# Altium project Accumulator_MGMT_Sys.PrjPcb (part 1 of 2)
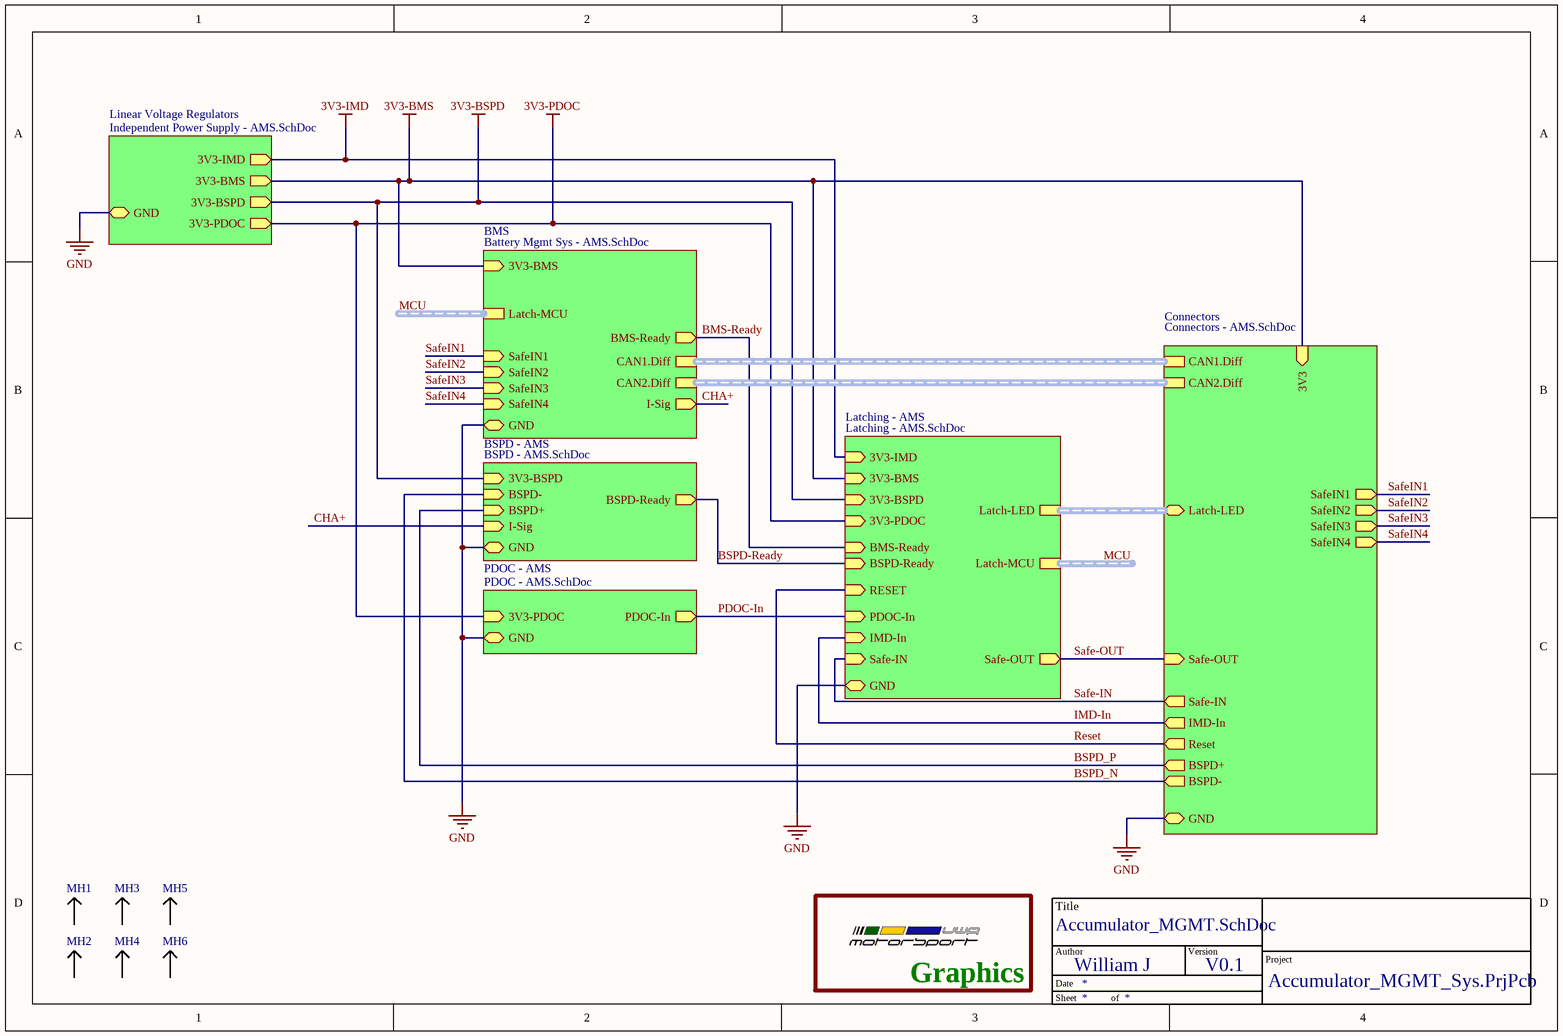
[diagram p0: Accumulator_MGMT.SchDoc]
ProAuthor: William J; ProjectTitle: Accumulator Management System; Version: V0.1
12 sheets, 240 parts. Net scope: hierarchical (ports join the sheet entries above them; power ports are global).
Board files: Accumulator Management.PcbDoc, AMS.PcbDoc
Sheets:
  Accumulator_MGMT.SchDoc
    BMS = Battery Mgmt Sys - AMS.SchDoc
      CAN-Trans = CAN - STM32F4.SchDoc
      Ext Current Sense = Current Sense - AMS.SchDoc
      Iso SPI Comms = Isolated Comms - AMS.SchDoc
    BSPD - AMS = BSPD - AMS.SchDoc
    Latching - AMS = Latching - AMS.SchDoc
      Latch Circuit = Latch - AMS.SchDoc
      Latch Circuit = Latch - AMS.SchDoc
      Latch Circuit = Latch - AMS.SchDoc
      Latch Circuit = Latch - AMS.SchDoc
    PDOC - AMS = PDOC - AMS.SchDoc
    Linear Voltage Regulators = Independent Power Supply - AMS.SchDoc
      Vbat-3V3 = LVR - AMS.SchDoc
      Vbat-3V3 = LVR - AMS.SchDoc
      Vbat-3V3 = LVR - AMS.SchDoc
    Connectors = Connectors - AMS.SchDoc

## Sheet Accumulator_MGMT.SchDoc
size A4

### Parts
(Parts that share a designator on the sheet are numbered #1, #2 ... from top to bottom, then left to right.)
*#1  TitleBlock  (value not drawn)  (graphical)
Graphic  UWAM Logo  [UWAM Logo]  (value not drawn)  (graphical)
MH1  M3 Mounting Hole  [M3 MH]  (value not drawn)  (no BOM)
MH2  M3 Mounting Hole  [M3 MH]  (value not drawn)  (no BOM)
MH3  M3 Mounting Hole  [M3 MH]  (value not drawn)  (no BOM)
MH4  M3 Mounting Hole  [M3 MH]  (value not drawn)  (no BOM)
MH5  M3 Mounting Hole  [M3 MH]  (value not drawn)  (no BOM)
MH6  M3 Mounting Hole  [M3 MH]  (value not drawn)  (no BOM)

### Blocks framed on the sheet
Graphics: Graphic

### Sub-sheets
BMS = Battery Mgmt Sys - AMS.SchDoc: BMS-Ready (out), 3V3-BMS (in), CAN1.Diff (harness CANDiff), CAN2.Diff (harness CANDiff), GND (bidir), I-Sig (out), SafeIN1 (in), SafeIN2 (in), SafeIN3 (in), SafeIN4 (in), Latch-MCU (harness Latch-MCU)
BSPD - AMS = BSPD - AMS.SchDoc: BSPD-Ready (out), 3V3-BSPD (in), BSPD- (in), BSPD+ (in), GND (bidir), I-Sig (in)
Connectors = Connectors - AMS.SchDoc: CAN1.Diff (harness CANDiff), CAN2.Diff (harness CANDiff), Safe-OUT (in), BSPD+ (out), Reset (out), Safe-IN (out), IMD-In (out), 3V3 (in), BSPD- (out), SafeIN1 (out), SafeIN2 (out), SafeIN3 (out), SafeIN4 (out), GND (bidir), Latch-LED (bidir, harness Latch-LED)
Latching - AMS = Latching - AMS.SchDoc: 3V3-IMD (in), 3V3-BMS (in), 3V3-BSPD (in), 3V3-PDOC (in), BSPD-Ready (in), BMS-Ready (in), PDOC-In (in), IMD-In (in), Safe-OUT (out), Safe-IN (in), RESET (in), GND (bidir), Latch-MCU (harness Latch-MCU), Latch-LED (harness Latch-LED)
Linear Voltage Regulators = Independent Power Supply - AMS.SchDoc: 3V3-IMD (out), 3V3-BMS (out), 3V3-BSPD (out), 3V3-PDOC (out), GND (bidir)
PDOC - AMS = PDOC - AMS.SchDoc: PDOC-In (out), 3V3-PDOC (in), GND (bidir)

### Nets
3V3-BMS: sheet BMS/3V3-BMS, sheet BSPD - AMS/3V3-BSPD, sheet Latching - AMS/3V3-IMD, sheet Latching - AMS/3V3-BMS, sheet Latching - AMS/3V3-BSPD, sheet Latching - AMS/3V3-PDOC, sheet PDOC - AMS/3V3-PDOC, sheet Linear Voltage Regulators/3V3-IMD, sheet Linear Voltage Regulators/3V3-BMS, sheet Linear Voltage Regulators/3V3-BSPD, sheet Linear Voltage Regulators/3V3-PDOC, sheet Connectors/3V3  [also labelled 3V3-BSPD, 3V3-IMD, 3V3-PDOC]
GND: sheet BMS/GND, sheet BSPD - AMS/GND, sheet Latching - AMS/GND, sheet PDOC - AMS/GND, sheet Linear Voltage Regulators/GND, sheet Connectors/GND
BMS-Ready: sheet BMS/BMS-Ready, sheet Latching - AMS/BMS-Ready
BSPD-Ready: sheet BSPD - AMS/BSPD-Ready, sheet Latching - AMS/BSPD-Ready
BSPD_N: sheet BSPD - AMS/BSPD-, sheet Connectors/BSPD-
BSPD_P: sheet BSPD - AMS/BSPD+, sheet Connectors/BSPD+
CHA+: sheet BMS/I-Sig, sheet BSPD - AMS/I-Sig
IMD-In: sheet Latching - AMS/IMD-In, sheet Connectors/IMD-In
PDOC-In: sheet Latching - AMS/PDOC-In, sheet PDOC - AMS/PDOC-In
Reset: sheet Latching - AMS/RESET, sheet Connectors/Reset
Safe-IN: sheet Latching - AMS/Safe-IN, sheet Connectors/Safe-IN
Safe-OUT: sheet Latching - AMS/Safe-OUT, sheet Connectors/Safe-OUT
SafeIN1: sheet BMS/SafeIN1, sheet Connectors/SafeIN1
SafeIN2: sheet BMS/SafeIN2, sheet Connectors/SafeIN2
SafeIN3: sheet BMS/SafeIN3, sheet Connectors/SafeIN3
SafeIN4: sheet BMS/SafeIN4, sheet Connectors/SafeIN4

Not connected (* = marked no-connect by the designer): MH1 1; MH2 1; MH3 1; MH4 1; MH5 1; MH6 1

### Buses and harness runs
harness MCU = sheet BMS/Latch-MCU
harness MCU = sheet Latching - AMS/Latch-MCU
harness sheet BMS/CAN1.Diff = sheet Connectors/CAN1.Diff
harness sheet BMS/CAN2.Diff = sheet Connectors/CAN2.Diff
harness sheet Connectors/Latch-LED = sheet Latching - AMS/Latch-LED

### Notes on the sheet
- (in symbol TitleBlock) Title; Author; Version; Project; Date; Sheet; of

## Sheet Battery Mgmt Sys - AMS.SchDoc
size A4
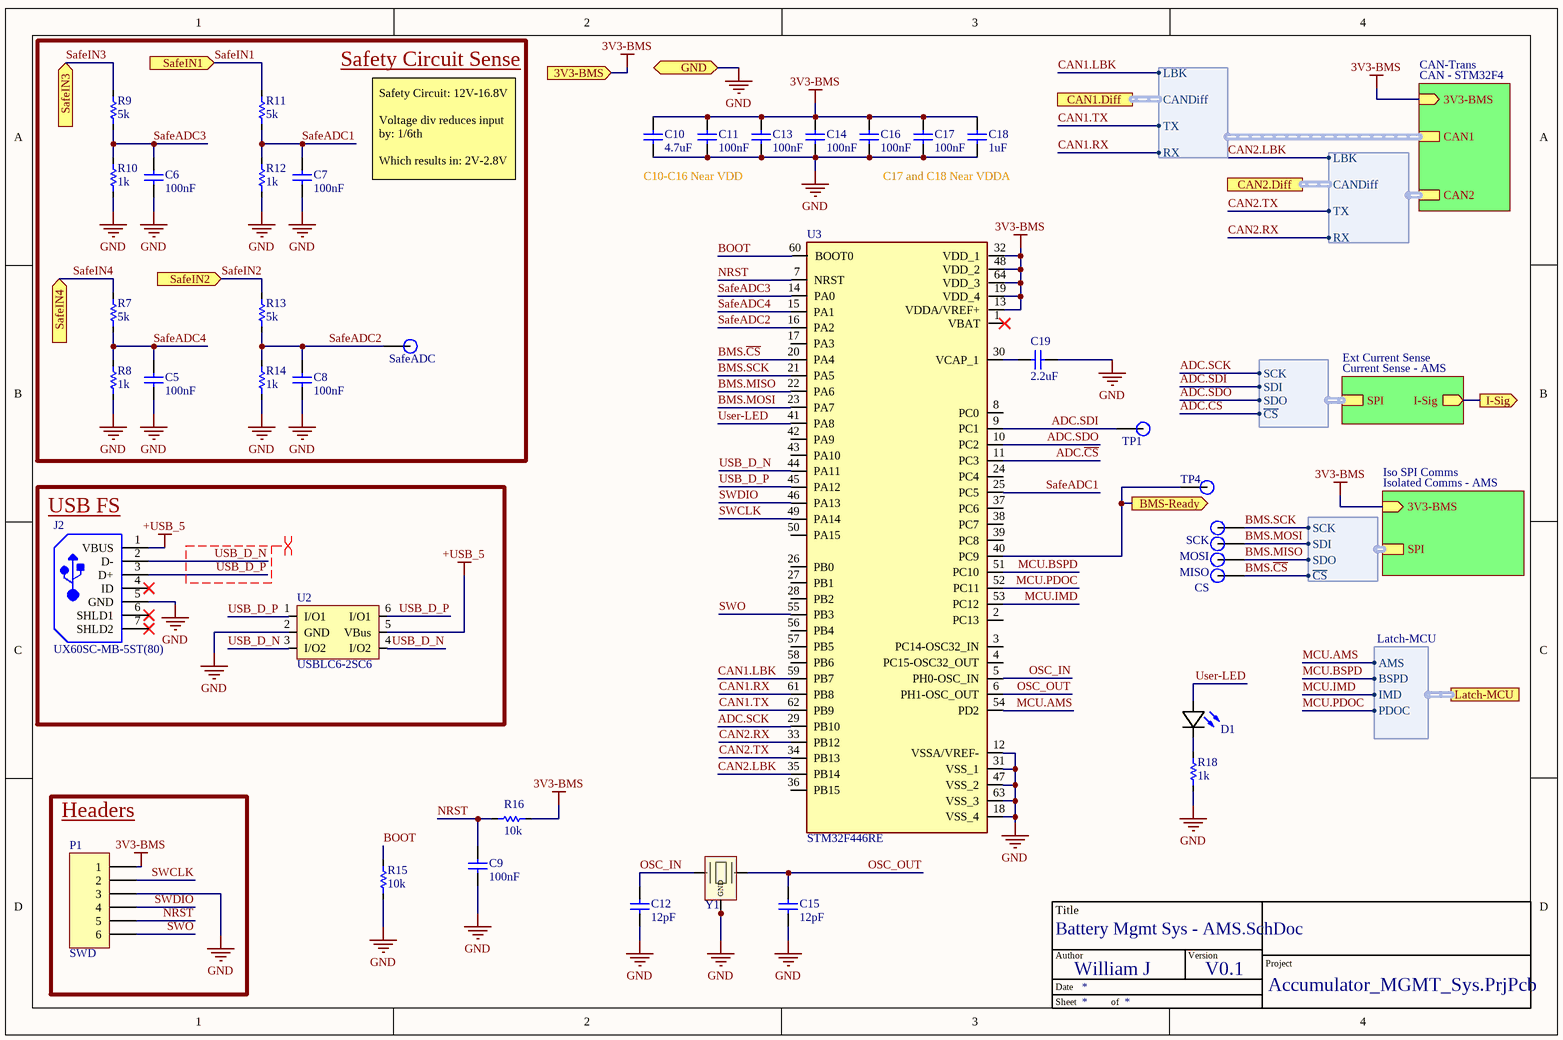
[diagram p1: Battery Mgmt Sys - AMS.SchDoc]

### Parts
(Parts that share a designator on the sheet are numbered #1, #2 ... from top to bottom, then left to right.)
*#2  TitleBlock  (value not drawn)  (graphical)
C5  value 100nF  [C_0603]  (hidden comment: C0603C104K3RAC7013)
C6  value 100nF  [C_0603]  (hidden comment: C0603C104K3RAC7013)
C7  value 100nF  [C_0603]  (hidden comment: C0603C104K3RAC7013)
C8  value 100nF  [C_0603]  (hidden comment: C0603C104K3RAC7013)
C9  value 100nF  [C_0603]  (hidden comment: C0603C104K3RAC7013)
C10  value 4.7uF  [C_0603]  (hidden comment: CL10A475KP8NNNL)
C11  value 100nF  [C_0603]  (hidden comment: C0603C104K3RAC7013)
C12  value 12pF  [0402]  (hidden comment: GCM1555C1H120FA16D)
C13  value 100nF  [C_0603]  (hidden comment: C0603C104K3RAC7013)
C14  value 100nF  [C_0603]  (hidden comment: C0603C104K3RAC7013)
C15  value 12pF  [0402]  (hidden comment: GCM1555C1H120FA16D)
C16  value 100nF  [C_0603]  (hidden comment: C0603C104K3RAC7013)
C17  value 100nF  [C_0603]  (hidden comment: C0603C104K3RAC7013)
C18  value 1uF  [C_0603]  (hidden comment: CL10A105KP8NNNL)
C19  value 2.2uF  [C_0603]  (hidden comment: CL10A225KP8NNNC)
CS  Test Point  [Test Point]  (value not drawn)  (no BOM)
D1  150060BS55040  [LED (0603)]  (value not drawn)
J2  UX60SC-MB-5ST(80)  [HIRO-UX60SC-MB-5ST(80)_V]
MISO  Test Point  [Test Point]  (value not drawn)  (no BOM)
MOSI  Test Point  [Test Point]  (value not drawn)  (no BOM)
P1  SWD  [HDR1X6]  (no BOM)
R7  value 5k  [R-0603]  (hidden comment: CR0603AFX-5101EAS)
R8  value 1k  [R-0603]  (hidden comment: CR0603AFX-1001ELF)
R9  value 5k  [R-0603]  (hidden comment: CR0603AFX-5101EAS)
R10  value 1k  [R-0603]  (hidden comment: CR0603AFX-1001ELF)
R11  value 5k  [R-0603]  (hidden comment: CR0603AFX-5101EAS)
R12  value 1k  [R-0603]  (hidden comment: CR0603AFX-1001ELF)
R13  value 5k  [R-0603]  (hidden comment: CR0603AFX-5101EAS)
R14  value 1k  [R-0603]  (hidden comment: CR0603AFX-1001ELF)
R15  value 10k  [R-0603]  (hidden comment: RC0603FR-1310KL)
R16  value 10k  [R-0603]  (hidden comment: RC0603FR-1310KL)
R18  value 1k  [R-0603]  (hidden comment: CR0603AFX-1001ELF)
SafeADC  Test Point  [Test Point]  (value not drawn)  (no BOM)
SCK  Test Point  [Test Point]  (value not drawn)  (no BOM)
TP1  Test Point  [Test Point]  (value not drawn)  (no BOM)
TP4  Test Point  [Test Point]  (value not drawn)  (no BOM)
U2  USBLC6-2SC6  [USBLC6-2SC6]
U3  STM32F446RE  [QFP50P1200X1200X160-64N]
Y1  CX2016DB26000D0FLJCC  [CX2016DB26000D0FLJCC]  (value not drawn)

### Blocks framed on the sheet
Safety Circuit Sense: C5-C8 R7-R14 SafeADC
USB FS: J2 U2
Headers: P1

### Sub-sheets
CAN-Trans = CAN - STM32F4: CAN2 (harness CAN), CAN1 (harness CAN), 3V3-BMS (in)
Ext Current Sense = Current Sense - AMS: SPI (harness SPI), I-Sig (out)
Iso SPI Comms = Isolated Comms - AMS: SPI (harness SPI), 3V3-BMS (in)

### Ports
3V3-BMS (in), BMS-Ready (out), CAN1.Diff (harness CANDiff), CAN2.Diff (harness CANDiff), GND (bidir), I-Sig (out), Latch-MCU (harness Latch-MCU), SafeIN1 (in), SafeIN2 (in), SafeIN3 (in), SafeIN4 (in)

### Harnesses
SPI: SDI, SDO, ~{CS}, SCK
CAN: LBK, CANDiff, TX, RX
Latch-MCU: AMS, BSPD, IMD, PDOC

### Nets
3V3-BMS: C10.2 C11.2 C13.2 C14.2 C16.2 C17.2 C18.2 P1.1 R16.2 U3.13(VDDA/VREF+) U3.19(VDD_4) U3.32(VDD_1) U3.48(VDD_2) U3.64(VDD_3) ; port 3V3-BMS, sheet CAN-Trans/3V3-BMS, sheet Iso SPI Comms/3V3-BMS
+USB_5: J2.1(VBUS) U2.5(VBus)
GND: C5.1 C6.1 C7.1 C8.1 C9.1 C10.1 C11.1 C12.1 C13.1 C14.1 C15.1 C16.1 C17.1 C18.1 C19.1 J2.5(GND) P1.3 R8.1 R10.1 R12.1 R14.1 R15.1 R18.1 U2.2(GND) U3.12(VSSA/VREF-) U3.18(VSS_4) U3.31(VSS_1) U3.47(VSS_2) U3.63(VSS_3) Y1.2(GND) Y1.4(GND) ; port GND
ADC.~{CS}: U3.11(PC3) ; sheet Ext Current Sense/SPI.~{CS}
ADC.SCK: U3.29(PB10) ; sheet Ext Current Sense/SPI.SCK
ADC.SDI: TP1.1 U3.9(PC1) ; sheet Ext Current Sense/SPI.SDI
ADC.SDO: U3.10(PC2) ; sheet Ext Current Sense/SPI.SDO
BMS-Ready: TP4.1 U3.40(PC9) ; port BMS-Ready
BMS.~{CS}: CS.1 U3.20(PA4) ; sheet Iso SPI Comms/SPI.~{CS}
BMS.MISO: MISO.1 U3.22(PA6) ; sheet Iso SPI Comms/SPI.SDO
BMS.MOSI: MOSI.1 U3.23(PA7) ; sheet Iso SPI Comms/SPI.SDI
BMS.SCK: SCK.1 U3.21(PA5) ; sheet Iso SPI Comms/SPI.SCK
BOOT: R15.2 U3.60(BOOT0)
CAN1.LBK: U3.59(PB7) ; sheet CAN-Trans/CAN1.LBK
CAN1.RX: U3.61(PB8) ; sheet CAN-Trans/CAN1.RX
CAN1.TX: U3.62(PB9) ; sheet CAN-Trans/CAN1.TX
CAN2.LBK: U3.35(PB14) ; sheet CAN-Trans/CAN2.LBK
CAN2.RX: U3.33(PB12) ; sheet CAN-Trans/CAN2.RX
CAN2.TX: U3.34(PB13) ; sheet CAN-Trans/CAN2.TX
CHA+: port I-Sig, sheet Ext Current Sense/I-Sig
MCU.AMS: U3.54(PD2) ; port Latch-MCU.AMS
MCU.BSPD: U3.51(PC10) ; port Latch-MCU.BSPD
MCU.IMD: U3.53(PC12) ; port Latch-MCU.IMD
MCU.PDOC: U3.52(PC11) ; port Latch-MCU.PDOC
NRST: C9.2 P1.5 R16.1 U3.7(NRST)
OSC_IN: C12.2 U3.5(PH0-OSC_IN) Y1.1
OSC_OUT: C15.2 U3.6(PH1-OSC_OUT) Y1.3
SafeADC1: C7.2 R11.1 R12.2 U3.25(PC5)
SafeADC2: C8.2 R13.1 R14.2 SafeADC.1 U3.16(PA2)
SafeADC3: C6.2 R9.1 R10.2 U3.14(PA0)
SafeADC4: C5.2 R7.1 R8.2 U3.15(PA1)
SafeIN1: R11.2 ; port SafeIN1
SafeIN2: R13.2 ; port SafeIN2
SafeIN3: R9.2 ; port SafeIN3
SafeIN4: R7.2 ; port SafeIN4
SWCLK: P1.2 U3.49(PA14)
SWDIO: P1.4 U3.46(PA13)
SWO: P1.6 U3.55(PB3)
USB_D_N: J2.2(D-) U2.3(I/O2) U2.4(I/O2) U3.44(PA11)
USB_D_P: J2.3(D+) U2.1(I/O1) U2.6(I/O1) U3.45(PA12)
User-LED: D1.2(A) U3.41(PA8)
NetC19_2: C19.2 U3.30(VCAP_1)
NetD1_1: D1.1(K) R18.2

Not connected (* = marked no-connect by the designer): J2 4(ID)* 6(SHLD1)* 7(SHLD2)*; U3 1(VBAT)* 2(PC13) 3(PC14-OSC32_IN) 4(PC15-OSC32_OUT) 8(PC0) 17(PA3) 24(PC4) 26(PB0) 27(PB1) 28(PB2) 36(PB15) 37(PC6) 38(PC7) 39(PC8) 42(PA9) 43(PA10) 50(PA15) 56(PB4) 57(PB5) 58(PB6)

### Layout directives
differential pair; net class USB_Diff: USB_D_N, USB_D_P

### Notes on the sheet
- Safety Circuit: 12V-16.8V
  Voltage div reduces input by: 1/6th
  Which results in: 2V-2.8V
- C10-C16 Near VDD
- C17 and C18 Near VDDA
- (in symbol TitleBlock) Title; Author; Version; Project; Date; Sheet; of

### Library data of the parts
C5-C19 = Capacitor: ComponentLink1Description: New link; ComponentLink1URL: *
CS MISO MOSI SafeADC SCK TP1 TP4 = Test Point: 1.2mm Test point
D1 = 150060BS55040: LED BLUE DIFFUSED 0603 SMD; Manufacturer: Wurth Electronics; Lens Style: Flat; Luminous Intensity: 80mcd; Forward Voltage: 3.2V; Test Current: 20mA; Viewing Angle: 140°; Dominant Wavelength: 470nm; Lens Size: 0.8mm; Supplier 1: Mouser; Manufacturer Part Number: 150060BS55040; RoHS: No; Pricing 1: 1=0.18000, 10=0.16800, 50=0.16800, 100=0.15200, 1000=0.12100, 10000=0.10600 (USD); Mount: Surface Mount; Case/Package: 0603; Color: Blue; Packaging: Tape and Reel; Lens Transparency: Diffused; Length: 1.6mm; Width: 0.8mm; Height: 0.5mm; RoHS Compliant: No; ComponentLink1URL: http://www.farnell.com/datasheets/2621640.pdf?src-supplier=Farnell; ComponentLink1Description: http://www.farnell.com/datasheets/2621640.pdf?src-supplier=Farnell; ComponentLink2URL: https://www.we-online.de/web/en/index.php/download/media/07_electronic_components/download_center_1/application_notes_berichte/ano002_leds___the_future_of_horticultural_lighting/ANO002b_EN_LEDs_The_Future_of_Horticultural_Lighting.pdf?src-supplier=Digi-Key; ComponentLink2Description: https://www.we-online.de/web/en/index.php/download/media/07_electronic_components/download_center_1/application_notes_berichte/ano002_leds___the_future_of_horticultural_lighting/ANO002b_EN_LEDs_The_Future_of_Horticultural_Lighting.pdf?src-supplier=Digi-Key; ComponentLink3URL: https://katalog.we-online.de/pbs/datasheet/150060BS55040.pdf?src-supplier=Digi-Key; ComponentLink3Description: https://katalog.we-online.de/pbs/datasheet/150060BS55040.pdf?src-supplier=Digi-Key; ComponentLink4URL: http://www.farnell.com/datasheets/2621640.pdf?src-supplier=Newark; ComponentLink4Description: http://www.farnell.com/datasheets/2621640.pdf?src-supplier=Newark; Supplier Part Number 1: 710-150060BS55040
J2 = CMP-2000-07376-1: Mini-B Connector, SMT Mount Receptacle Meeting Requirement of USB 2.0 Standard, 5 V, 1 A, -30 to 75 degC, 5-Pin SMD, RoHS, Tape and Reel; Manufacturer: Hirose Electric; Product Length (mm): 7.7mm; Voltage Rating Max: 5VAC; Number of Contacts: 5POS; Number of Ports: 1Port; Product Height (mm): 3.95mm; Product Depth (mm): 7mm; Pitch (mm): 0.8mm; Gender: RCP; Current Rating (Max): 1A; DELETED: Compliant; Product Diameter (mm): NotRequiredmm; Body Orientation: RightAngle; Operating Temp Range: -30Cto75C; Packaging: TapeandReel; Termination Method: Solder; Number of Terminals: 5; Package Description: 5-Pin Surface Mount Device, Body 7.7 x 7 mm, Pitch 0.8 mm; Mounting Technology: SurfaceMount; Contact Material: CopperAlloy; Package Reference: UX60SC-MB-5ST(80); Operating Temperature Min Deg. C: -30C; Housing Material: Synthetic; Operating Temperature Max Deg. C: 75C; Manufacturer URL: https://www.hirose.com; Datasheet Version: 04/2008; Type: Mini-USB; Datasheet URL: https://datasheet.ciiva.com/4598/e24000153-34949-4598883.pdf; Contact Plating: Gold; Mounting Style: ThroughHole
P1 = Header 6: Header, 6-Pin; LatestRevisionDate: 17-Jul-2002; LatestRevisionNote: Re-released for DXP Platform.; Publisher: Altium Limited
R7 R9 R11 R13 R15 R16 R18 = Resistor
R8 R10 R12 R14 = Resistor: Voltage divider
U2 = USBLC6-2SC6: TVS DIODE 5.25V 17V SOT23-6; Manufacturer: STMicroelectronics; Direction: Unidirectional,Bidirectional; Capacitance: 3.5pF; Operating Supply Voltage: 1.1V; Number of Channels: 2; Breakdown Voltage: 6V; Power Line Protection: Yes; Test Current: 1mA; Max Reverse Leakage Current: 150nA; Peak Pulse Current: 5A; Element Configuration: Dual; Data Rate: 480Mbps; Number of Elements: 1; Working Voltage: 5V; Supplier 1: RSComponents; Manufacturer Part Number: USBLC6-2SC6; RoHS: Yes; Category: TVS Diodes; Stock 1: 1; Pricing 1: 10=0.61400, 50=0.57700, 100=0.54700, 250=0.51600, 500=0.49000 (USD); Mount: Surface Mount; Case/Package: SOT-23; Number of Pins: 6; Contact Plating: Tin,Matte; Min Operating Temperature: -40°C; Max Operating Temperature: 125°C; Clamping Voltage: 17V; Packaging: Tape and Reel; Package Quantity: 3000; Termination: SMD/SMT; Number of Bidirectional Channels: 2; Reverse Standoff Voltage: 5.25V; Min Breakdown Voltage: 6V; ESD Protection: Yes; Leakage Current: 150nA; Series: USB; Reverse Breakdown Voltage: 6V; Polarity: Unidirectional,Bidirectional; Max Breakdown Voltage: 6V; Clamping Voltage-Max: 17V; Length: 3.05mm; Width: 1.75mm; Height: 1.3mm; Depth: 1.75mm; Radiation Hardening: No; REACH SVHC: No SVHC; Lead Free: Lead Free; RoHS Compliant: Yes; ComponentLink1URL: https://datasheet.ciiva.com/1268/1690354-1268384.pdf?src-supplier=Element14; ComponentLink1Description: https://datasheet.ciiva.com/1268/1690354-1268384.pdf?src-supplier=Element14; ComponentLink2URL: https://datasheet.ciiva.com/4508/cd00050750-113117-4508433.pdf?src-supplier=Mouser; ComponentLink2Description: https://datasheet.ciiva.com/4508/cd00050750-113117-4508433.pdf?src-supplier=Mouser; ComponentLink3URL: https://datasheet.ciiva.com/15143/getdatasheetpartid-148465-15143789.pdf?src-supplier=Verical; ComponentLink3Description: https://datasheet.ciiva.com/15143/getdatasheetpartid-148465-15143789.pdf?src-supplier=Verical; ComponentLink4URL: https://datasheet.ciiva.com/26787/usblc6-2sc6-26787908.pdf?src-supplier=IIIC; ComponentLink4Description: https://datasheet.ciiva.com/26787/usblc6-2sc6-26787908.pdf?src-supplier=IIIC; ComponentLink5URL: https://datasheet.ciiva.com/16200/cd00050750-16200026.pdf?src-supplier=Future+Electronics; ComponentLink5Description: https://datasheet.ciiva.com/16200/cd00050750-16200026.pdf?src-supplier=Future+Electronics; ComponentLink6URL: https://datasheet.ciiva.com/41444/001184109-da-01-en-ic-esd-protecti-usblc6-2sc6-sot-23-6-stm-41444156.pdf?src-supplier=Conrad; ComponentLink6Description: https://datasheet.ciiva.com/41444/001184109-da-01-en-ic-esd-protecti-usblc6-2sc6-sot-23-6-stm-41444156.pdf?src-supplier=Conrad; Supplier Part Number 1: 6247693
U3 = STM32F446RE: 32 Bit Microcontroller, High Performance, ARM Cortex-M4, 180 MHz, 256 KB, 128 KB, 64, LQFP; MP: STM32F446RE; Value: *
Y1 = CX2016DB26000D0FLJCC: Crystals AEC-Q200 26000kHz 8pF 2x1.6mm

## Sheet CAN - STM32F4.SchDoc
size A4
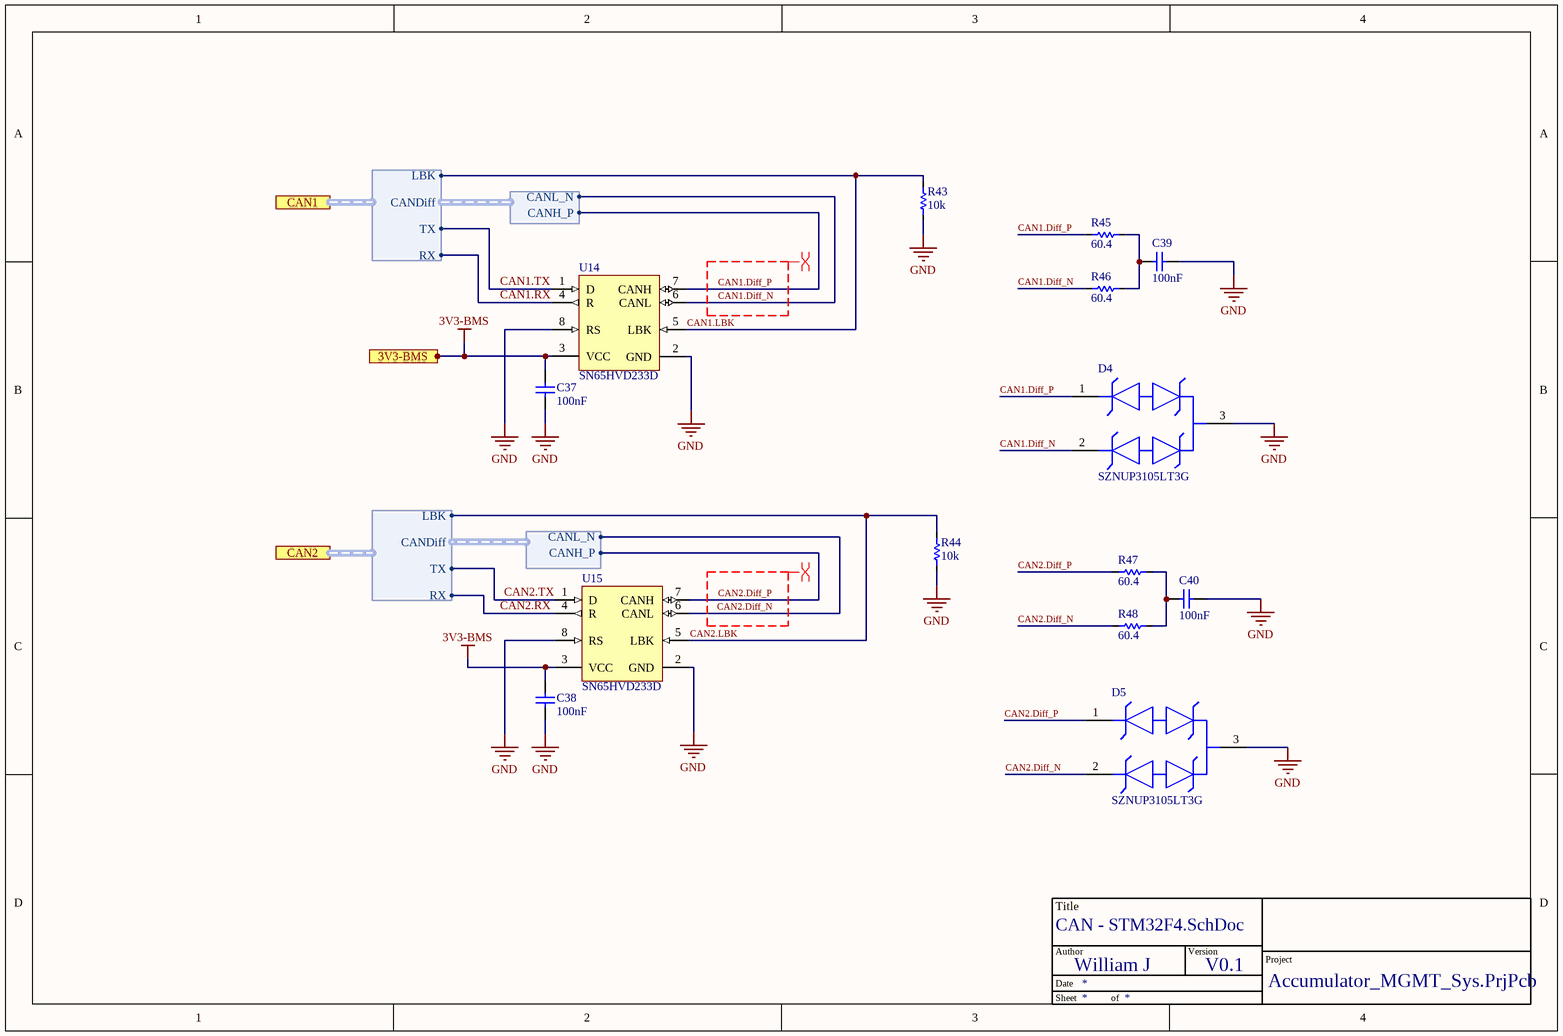
[diagram p2: CAN - STM32F4.SchDoc]

### Parts
(Parts that share a designator on the sheet are numbered #1, #2 ... from top to bottom, then left to right.)
*#3  TitleBlock  (value not drawn)  (graphical)
C37  value 100nF  [C_0603]  (hidden comment: C0603C104K3RAC7013)
C38  value 100nF  [C_0603]  (hidden comment: C0603C104K3RAC7013)
C39  value 100nF  [C_0603]  (hidden comment: C0603C104K3RAC7013)
C40  value 100nF  [C_0603]  (hidden comment: C0603C104K3RAC7013)
D4  SZNUP3105LT3G  [FP-318-08-MFG]
D5  SZNUP3105LT3G  [FP-318-08-MFG]
R43  value 10k  [R-0603]  (hidden comment: RC0603FR-1310KL)
R44  value 10k  [R-0603]  (hidden comment: RC0603FR-1310KL)
R45  value 60.4  [R-0603]  (hidden comment: CRCW080560R4FKEA)
R46  value 60.4  [R-0603]  (hidden comment: CRCW080560R4FKEA)
R47  value 60.4  [R-0603]  (hidden comment: CRCW080560R4FKEA)
R48  value 60.4  [R-0603]  (hidden comment: CRCW080560R4FKEA)
U14  SN65HVD233D  [D0008A_N]
U15  SN65HVD233D  [D0008A_N]

### Ports
3V3-BMS (in), CAN1 (harness CAN), CAN2 (harness CAN)

### Harnesses
CAN: LBK, CANDiff, TX, RX
CANDiff: CANL_N, CANH_P
CANDiff: CANH_P, CANL_N

### Nets
3V3-BMS: C37.2 C38.2 U14.3(VCC) U15.3(VCC) ; port 3V3-BMS
GND: C37.1 C38.1 C39.1 C40.1 D4.3 D5.3 R43.1 R44.1 U14.2(GND) U14.8(RS) U15.2(GND) U15.8(RS)
CAN1.Diff_N: D4.2 R46.1 U14.6(CANL) ; harness CANDiff.CANL_N
CAN1.Diff_P: D4.1 R45.1 U14.7(CANH) ; harness CANDiff.CANH_P
CAN1.LBK: R43.2 U14.5(LBK) ; port CAN1.LBK
CAN1.RX: U14.4(R) ; port CAN1.RX
CAN1.TX: U14.1(D) ; port CAN1.TX
CAN2.Diff_N: D5.2 R48.1 U15.6(CANL) ; harness CANDiff.CANL_N
CAN2.Diff_P: D5.1 R47.1 U15.7(CANH) ; harness CANDiff.CANH_P
CAN2.LBK: R44.2 U15.5(LBK) ; port CAN2.LBK
CAN2.RX: U15.4(R) ; port CAN2.RX
CAN2.TX: U15.1(D) ; port CAN2.TX
NetC39_2: C39.2 R45.2 R46.2
NetC40_2: C40.2 R47.2 R48.2

### Layout directives
differential pair; net class CAN_Diff; differential pair class CAN_Diff: CAN1.Diff_N, CAN1.Diff_P, CAN2.Diff_N, CAN2.Diff_P

### Notes on the sheet
- (in symbol TitleBlock) Title; Author; Version; Project; Date; Sheet; of

### Library data of the parts
C37-C40 = Capacitor: ComponentLink1Description: New link; ComponentLink1URL: *
D4 D5 = CMP-07200-000005-1: TVS DIODE 32V 66V SOT23-3; Manufacturer: ON Semiconductor; Max Junction Temp: +150°C; Standoff Height: 0.01mm; Peak Pulse Power: 350W; Breakdown Voltage: 35.6V; Automotive Grade: Grade 0; Number Of Channels: 2; Direction: Bidirectional; Peak Pulse Current: 8A; Height: 1.11mm; Mouser Description: 32V Dual Line CAN Bus Protector in SOT-23 AEC-Q 24 V CAN Bus Protector in SOT-23; Device Class L3: unset; Clamping Voltage: 66V; Manufacturer Part Number: SZNUP3105LT3G; ComponentLink2Description: Datasheet; Octopart: https://octopart.com/sznup3105lt3g-on+semiconductor-54318507; Temperature Range High: +150°C; Reverse Standoff Voltage: 32V; RoHS: TRUE; Package: 318-08; Device Class L2: TVS Diodes; Device Class L1: Circuit Protection; Temperature Range Low: -55°C; Lead Free: Yes; Temperature: -55°C to +150°C; ComponentLink2URL: https://www.onsemi.com/pub/Collateral/NUP3105L-D.PDF; Automotive: Yes; Footprint Url: https://www.onsemi.com/pub/Collateral/318-08.PDF; Digikey Description: TVS DIODE 32V 66V SOT23-3; Category: Diode
R43-R48 = Resistor
U14 U15 = CMP-0315-00036-2: 3.3V CAN Transceiver with Standby Mode, Loop-back, 6 mA, -40 to 125 degC, 8-pin SOIC (D), Green (RoHS & no Sb/Br); Manufacturer: Texas Instruments; Receivers Per Package: 1; Bus Fault Voltage(V): +/-30; Rating: Catalog; ICC(Max)(mA): 6; Supply Voltage(s)(V): 3.3; Transient Pulse Protection(V): -100 to 100; PackageVersion: revM, Jun-2011; PackageReference: D0008A; ComponentLink1Description: Datasheet; Isolated: No; Footprint: PCA82C250, excludes pin5; DatasheetVersion: SLLS557F; PackageDescription: 8-Pin Plastic Small Outline Integrated Circuit, 4.9 x 3.9 mm, Pitch 1.27 mm Pitch; Features: Loop Back; Low Power Mode: Standby; SubFamily: CAN; Drivers Per Package: 1; Eco-Plan: Green (RoHS & no Sb/Br); ComponentLink1URL: http://www.ti.com/general/docs/lit/getliterature.tsp?genericPartNumber=SN65HVD233&fileType=pdf; PartNumber: SN65HVD233D; Code_JEDEC: MS-012AA; Mounting Technology: Surface Mount

## Sheet Current Sense - AMS.SchDoc
size A4
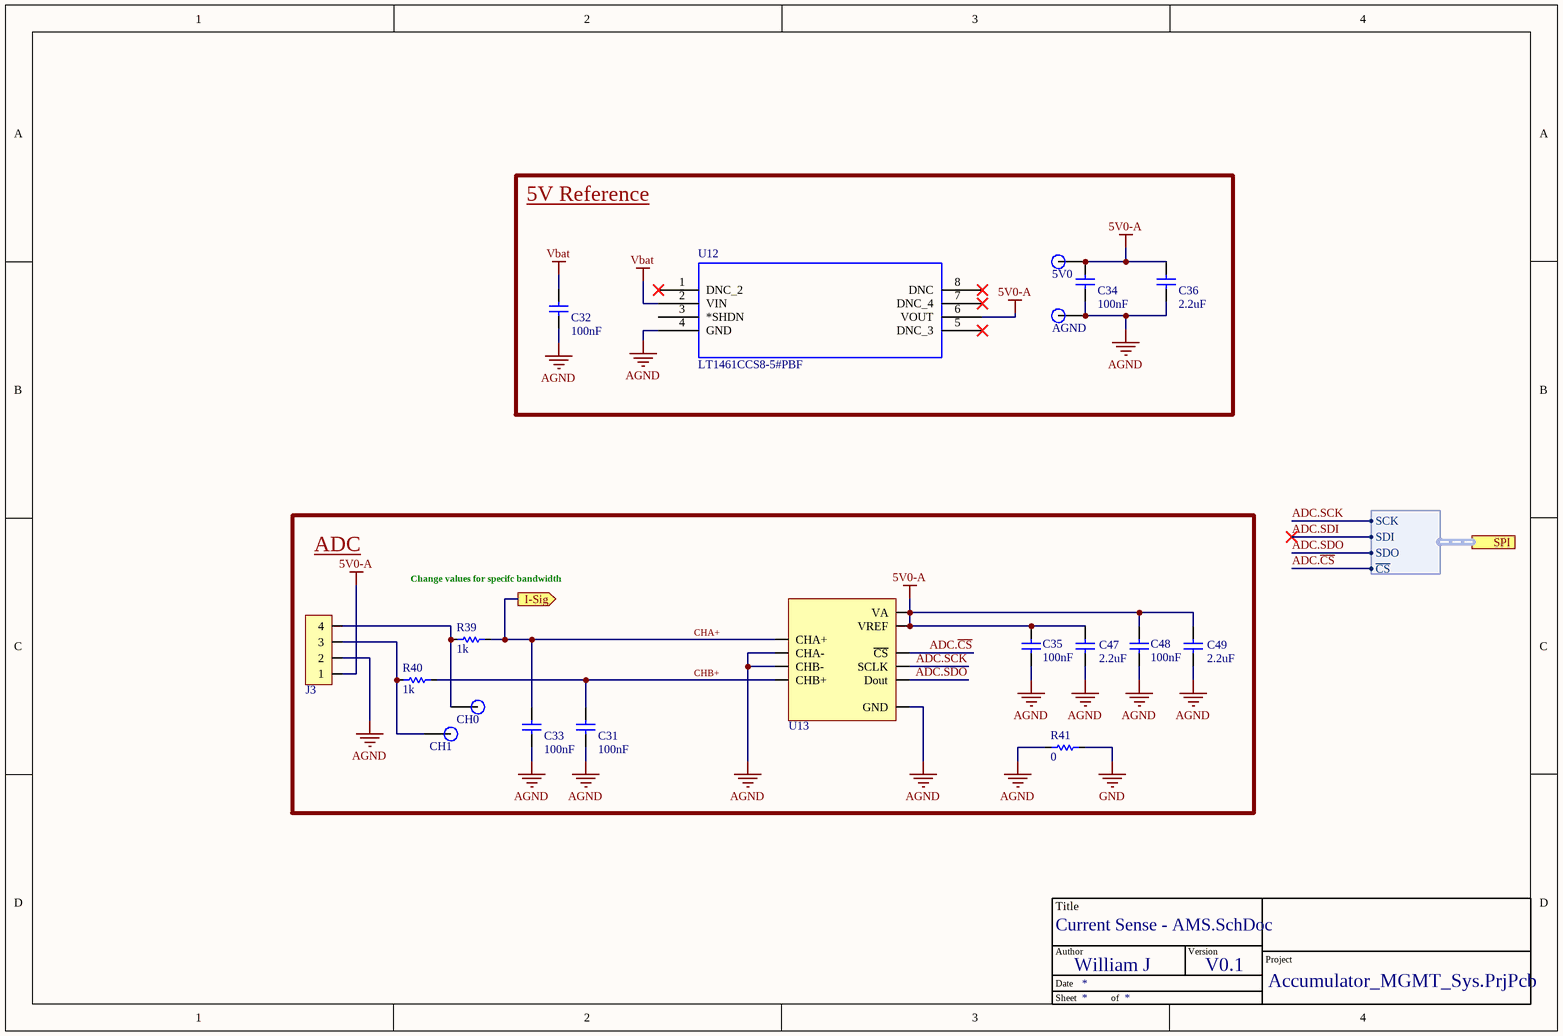
[diagram p3: Current Sense - AMS.SchDoc]

### Parts
(Parts that share a designator on the sheet are numbered #1, #2 ... from top to bottom, then left to right.)
5V0  1.2mm Test point  [Test Point]  (value not drawn)  (no BOM)
*#4  TitleBlock  (value not drawn)  (graphical)
AGND  1.2mm Test point  [Test Point]  (value not drawn)  (no BOM)
C31  value 100nF  [0402]  (hidden comment: C0603C104K3RAC7013)
C32  value 100nF  [C_0603]  (hidden comment: C0603C104K3RAC7013)
C33  value 100nF  [0402]  (hidden comment: C0603C104K3RAC7013)
C34  value 100nF  [C_0603]  (hidden comment: C0603C104K3RAC7013)
C35  value 100nF  [C_0603]  (hidden comment: C0603C104K3RAC7013)
C36  value 2.2uF  [C_0603]  (hidden comment: CL10A225KP8NNNC)
C47  value 2.2uF  [C_0603]  (hidden comment: CL10A225KP8NNNC)
C48  value 100nF  [C_0603]  (hidden comment: C0603C104K3RAC7013)
C49  value 2.2uF  [C_0603]  (hidden comment: CL10A225KP8NNNC)
CH0  1.2mm Test point  [Test Point]  (value not drawn)  (no BOM)
CH1  1.2mm Test point  [Test Point]  (value not drawn)  (no BOM)
J3  3-794632-4  [3-794632-4]  (value not drawn)
R39  value 1k  [R_0402]  (hidden comment: CRT0402-DY-1001GLF)
R40  value 1k  [R_0402]  (hidden comment: CRT0402-DY-1001GLF)
R41  value 0  [R-0603]  (hidden comment: AC0603JR-100RL)
U12  LT1461CCS8-5#PBF  [SO-8_S]
U13  ADC122S625CIMM/NOPB  [TSSOP50P490X110-10N]  (value not drawn)

### Blocks framed on the sheet
5V Reference: 5V0 AGND C32 C34 C36 U12
ADC: C31 C33 C35 C47-C49 CH0 CH1 J3 R39-R41 U13

### Ports
I-Sig (out), SPI (harness SPI)

### Harnesses
SPI: SDI, SDO, ~{CS}, SCK

### Nets
5V0-A: 5V0.1 C34.2 C35.2 C36.2 C47.2 C48.2 C49.2 J3.1 U12.6(VOUT) U13.1(VREF) U13.7(VA)
AGND: AGND.1 C31.1 C32.1 C33.1 C34.1 C35.1 C36.1 C47.1 C48.1 C49.1 J3.2 R41.1 U12.4(GND) U13.3(CHA-) U13.4(CHB-) U13.6(GND)
GND: R41.2
Vbat: C32.2 U12.2(VIN)
ADC.~{CS}: U13.10(~{CS}) ; port SPI.~{CS}
ADC.SCK: U13.9(SCLK) ; port SPI.SCK
ADC.SDO: U13.8(Dout) ; port SPI.SDO
CHA+: C33.2 R39.2 U13.2(CHA+) ; port I-Sig
CHB+: C31.2 R40.2 U13.5(CHB+)
NetCH0_1: CH0.1 J3.4 R39.1
NetCH1_1: CH1.1 J3.3 R40.1

Not connected (* = marked no-connect by the designer): U12 1(DNC_2)* 3(*SHDN) 5(DNC_3)* 7(DNC_4)* 8(DNC)*

### Notes on the sheet
- Change values for specifc bandwidth
- (in symbol TitleBlock) Title; Author; Version; Project; Date; Sheet; of

### Library data of the parts
5V0 AGND CH0 CH1 = Test Point
C31-C36 C47-C49 = Capacitor: ComponentLink1Description: New link; ComponentLink1URL: *
J3 = 3-794632-4: Conn Power HDR 4 POS 3mm Solder ST Thru-Hole 4 Terminal 1 Port Box/Tray; Manufacturer: TE Connectivity; Number of Terminals/Pins: 4; Max Voltage Rating (AC): 250V; Connector Type: Pin; Mating Retention: Yes (With); PCB Mount Alignment: No (Without); Current Rating: 5A; Number of Ports: 1; Connector System: Wire-to-Board; PCB Mount Retention: With; PCB Mounting Orientation: Vertical; VDE Tested: Yes; Pitch: 0.118inch; Row Spacing: 0.118mm; PCB Thickness: 1.57mm; Plating Thickness: 2.54um; Approvals: CSA; Supplier 1: Mouser; Manufacturer Part Number: 3-794632-4; RoHS: Yes; Category: Power Connectors; Stock 1: 833; Pricing 1: 1=1.68000, 10=1.43000, 50=1.43000, 100=1.24000, 377=1.09000, 1000=1.09000, 1131=0.93600, 2639=0.87300, 5278=0.83000, 10000=0.83000, 10179=0.81100, 25259=0.79100 (USD); Mount: Through Hole; Housing Color: Black; Contact Material: Brass; Color: Black; Housing Material: Nylon; Contact Plating: Gold,Tin; Min Operating Temperature: -40°C; Max Operating Temperature: 221°C; Packaging: Tray; Package Quantity: 377; Number of Rows: 2; Fastening Type: Ramp; Orientation: Straight; Number of Positions: 4; Termination: Solder; Number of Contacts: 4; Voltage Rating: 250V; Contact Gender: Male; Mating Alignment: Yes (With); Contact Current Rating: 5A; Contact Retention: No (Without); Sealable: No (Without); Circuit Application: Power; Number of Power Positions: 4; Length: 10mm; Width: 9.24mm; Height: 8.67mm; Depth: 8.67mm; Radiation Hardening: No; Flammability Rating: UL94 V-0; Lead Free: Lead Free; ELV: Compliant; ComponentLink1URL: https://datasheet.ciiva.com/717/eng-cd-794632-e-717814.pdf?src-supplier=Digi-Key; ComponentLink1Description: https://datasheet.ciiva.com/717/eng-cd-794632-e-717814.pdf?src-supplier=Digi-Key; ComponentLink2URL: https://datasheet.ciiva.com/30185/eng-cs-82181-softshell-high-density-0508-30185662.pdf?src-supplier=Onlinecomponents.com; ComponentLink2Description: https://datasheet.ciiva.com/30185/eng-cs-82181-softshell-high-density-0508-30185662.pdf?src-supplier=Onlinecomponents.com; Supplier Part Number 1: 571-3-794632-4
R39-R41 = Resistor
U12 = LT1461ACS8-3: MF: {'manufacturer': u'Analog Devices / Linear Technology'}; Price: None; Value: *; Availability: Unavailable; MP: LT1461ACS8-3; Package: None
U13 = ADC122S625CIMM/NOPB: Analog to Digital Converters - ADC Dual 50kSPS-200kSPS 12B ADC

## Sheet Isolated Comms - AMS.SchDoc
size A; ProAuthor: William Jupp; Version: V1.0
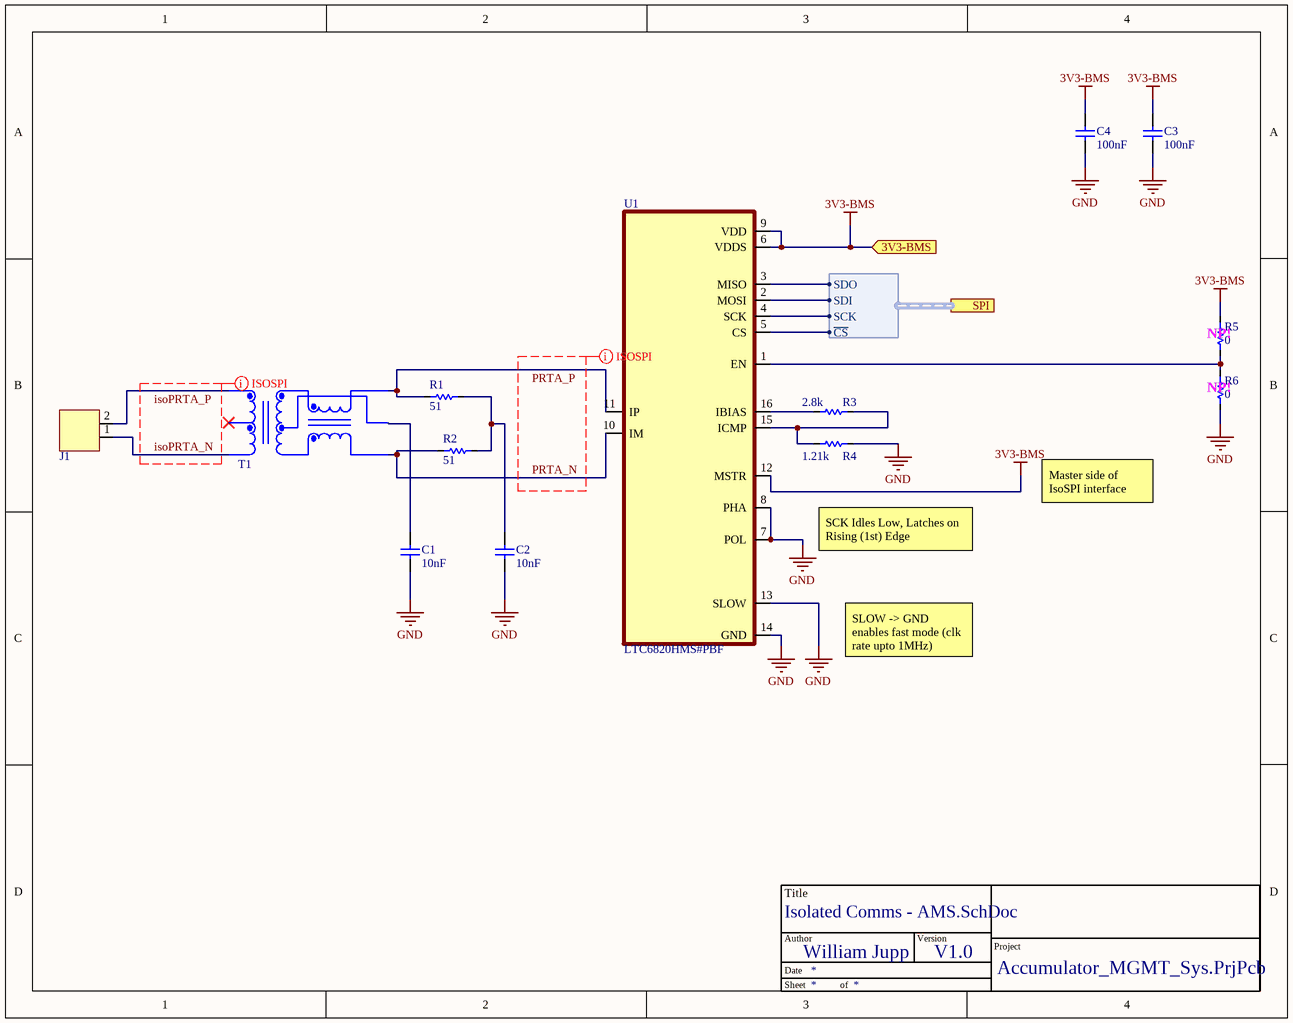
[diagram p4: Isolated Comms - AMS.SchDoc]

### Parts
(Parts that share a designator on the sheet are numbered #1, #2 ... from top to bottom, then left to right.)
*#5  TitleBlock  (value not drawn)  (graphical)
C1  value 10nF  [C_0603]  (hidden comment: 06035C103KAT4A)
C2  value 10nF  [C_0603]  (hidden comment: 06035C103KAT4A)
C3  value 100nF  [C_0603]  (hidden comment: C0603C104K3RAC7013)
C4  value 100nF  [C_0603]  (hidden comment: C0603C104K3RAC7013)
J1  3-794632-2  [3-794632-2]  (value not drawn)
R1  value 51  [R-0603]  (hidden comment: CRCW060351R0JNEA)
R2  value 51  [R-0603]  (hidden comment: CRCW060351R0JNEA)
R3  value 2.8k  [R-0603]  (hidden comment: RC0603FR-072K8L)
R4  value 1.21k  [R-0603]  (hidden comment: AC0603FR-071K21L)
R5  value 0  [R-0603]  (hidden comment: AC0603JR-100RL)
R6  value 0  [R-0603]  (hidden comment: AC0603JR-100RL)
T1  SM91502ALE  [SM91502ALE]  (value not drawn)
U1  LTC6820HMS#PBF  [MSOP-16_MS]

### Ports
3V3-BMS (in), SPI (harness SPI)

### Harnesses
SPI: SDI, SDO, ~{CS}, SCK

### Nets
3V3-BMS: C3.2 C4.2 R5.2 U1.6(VDDS) U1.9(VDD) U1.12(MSTR) ; port 3V3-BMS
GND: C1.1 C2.1 C3.1 C4.1 R4.2 R6.1 U1.7(POL) U1.8(PHA) U1.13(SLOW) U1.14(GND)
BMS.~{CS}: U1.5(CS) ; port SPI.~{CS}
BMS.MISO: U1.3(MISO) ; port SPI.SDO
BMS.MOSI: U1.2(MOSI) ; port SPI.SDI
BMS.SCK: U1.4(SCK) ; port SPI.SCK
isoPRTA_N: J1.1 T1.3
isoPRTA_P: J1.2 T1.1
PRTA_N: R2.1 T1.4 U1.10(IM)
PRTA_P: R1.1 T1.6 U1.11(IP)
NetC1_2: C1.2 T1.5
NetC2_2: C2.2 R1.2 R2.2
NetR3_1: R3.1 U1.16(IBIAS)
NetR3_2: R3.2 R4.1 U1.15(ICMP)
NetR5_1: R5.1 R6.2 U1.1(EN)

Not connected (* = marked no-connect by the designer): T1 2*

### Layout directives
differential pair; differential pair class ISO_SPI: isoPRTA_N, isoPRTA_P, PRTA_N, PRTA_P

### Notes on the sheet
- (near R5) NP!
- (near R6) NP!
- Master side of IsoSPI interface
- SCK Idles Low, Latches on Rising (1st) Edge
- SLOW -> GND enables fast mode (clk rate upto 1MHz)
- (in symbol TitleBlock) Title; Author; Version; Project; Date; Sheet; of

### Library data of the parts
C1-C4 = Capacitor: ComponentLink1Description: New link; ComponentLink1URL: *
J1 = 3-794632-2: Micro MATE-N-LOK, Rectangular Power Connectors, Header, Plug, Wire-to-Board, 2 Position
R1-R4 = Resistor
R5 R6 = Resistor: NP
T1 = SM91502ALE: BMS XFORMER 1-CH 1000V AECQ +125; Manufacturer: Bourns; Inductance: 150uH; Turns Ratio: 1:1; Supplier 1: RSComponents; Manufacturer Part Number: SM91502ALE; RoHS: Yes; Category: Transformers; Stock 1: 1; Pricing 1: 800=2.35100 (USD); Mount: Surface Mount; Min Operating Temperature: -40°C; Max Operating Temperature: 125°C; Packaging: Cut Tape; ComponentLink1URL: https://www.bourns.com/docs/Product-Datasheets/SM91502AL.pdf?src-supplier=Digi-Key; ComponentLink1Description: https://www.bourns.com/docs/Product-Datasheets/SM91502AL.pdf?src-supplier=Digi-Key; Supplier Part Number 1: 1802382
U1 = LTC6820HMS#PBF: IC COMM INTERFACE ISOSPI 16MSOP; Manufacturer: Analog Devices / Linear Technology; MF: {'manufacturer': u'Analog Devices Inc.'}; Interface: SPI; Min Supply Voltage: 2.7V; Max Supply Voltage: 5.5V; Availability: Unavailable; Price: None; Package: None; MP: LTC6820HMS#PBF; Value: *; Supplier 1: Mouser; Manufacturer Part Number: LTC6820HMS#PBF; RoHS: Yes; Category: Interface ICs; Pricing 1: 1=6.860000, 10=6.160000, 25=5.820000, 50=5.820000, 100=5.040000, 1000=4.780000, 10000=4.780000 (USD); Case/Package: MSOP; Number of Pins: 16; Min Operating Temperature: -40°C; Max Operating Temperature: 125°C; Package Quantity: 37; Packaging: Rail/Tube; Series: isoSPI; REACH SVHC: No SVHC; RoHS Compliant: Yes; ComponentLink1URL: https://datasheet.ciiva.com/22649/1730562-22649441.pdf?src-supplier=Element14; ComponentLink1Description: https://datasheet.ciiva.com/22649/1730562-22649441.pdf?src-supplier=Element14; ComponentLink2URL: https://datasheet.ciiva.com/6573/42317-6573703.pdf?src-supplier=Digi-Key; ComponentLink2Description: https://datasheet.ciiva.com/6573/42317-6573703.pdf?src-supplier=Digi-Key; ComponentLink3URL: https://datasheet.ciiva.com/22767/1730562-22767675.pdf?src-supplier=Farnell; ComponentLink3Description: https://datasheet.ciiva.com/22767/1730562-22767675.pdf?src-supplier=Farnell; Supplier Part Number 1: 584-LTC6820HMS#PBF

## Sheet BSPD - AMS.SchDoc
size A4
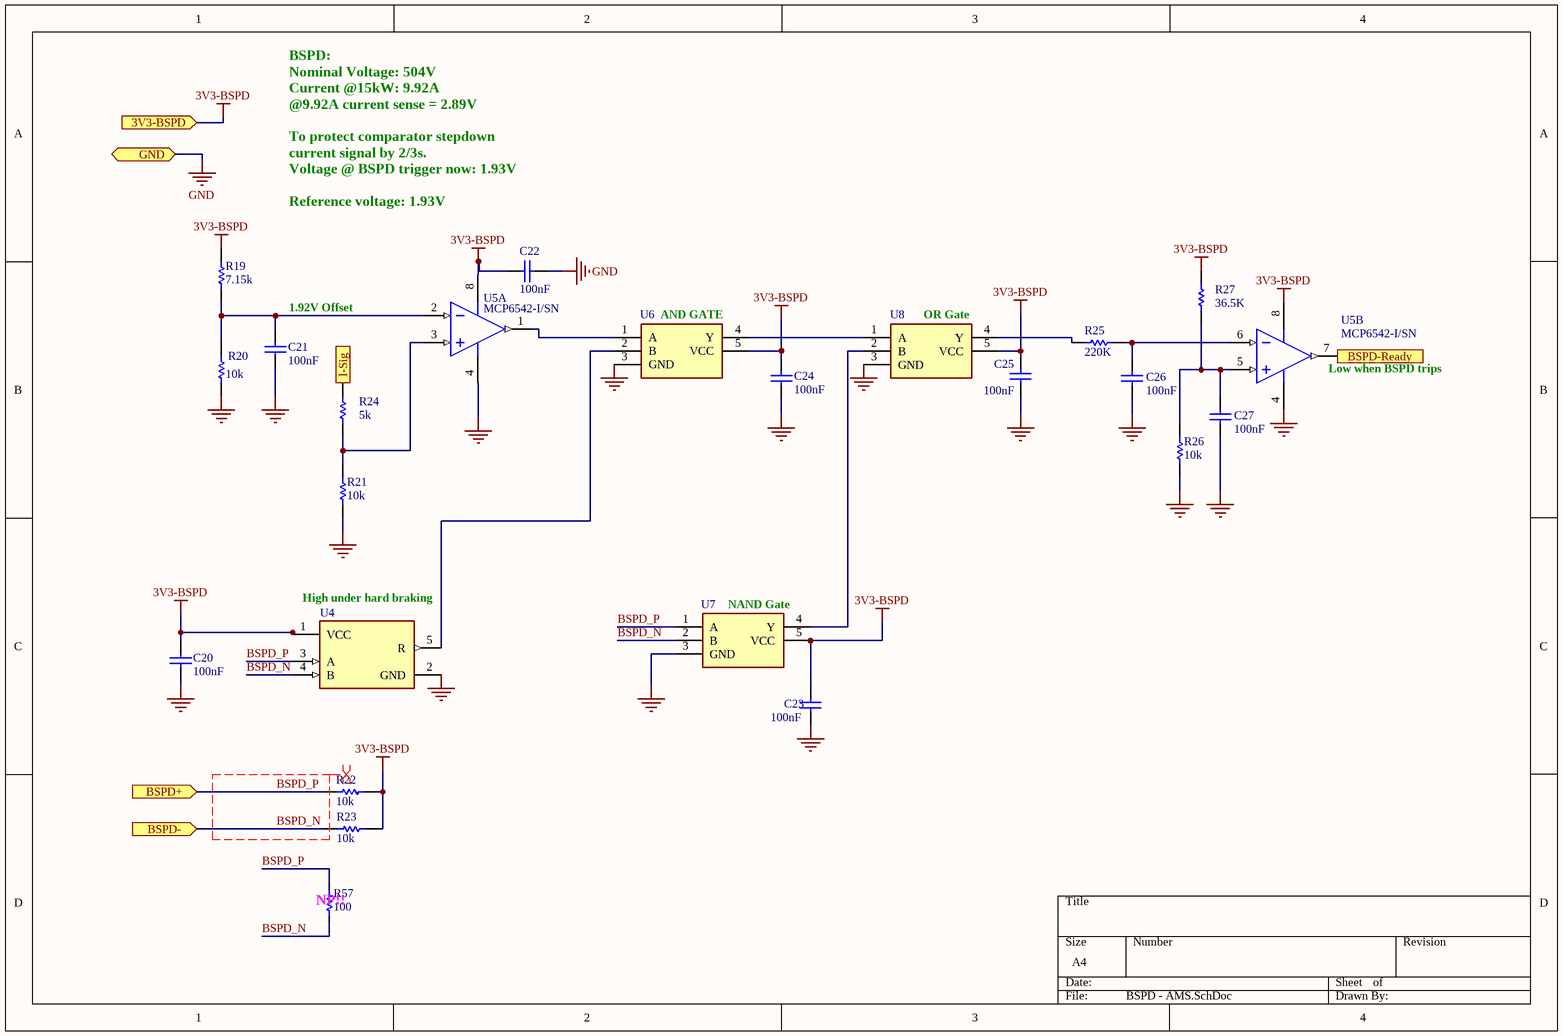
[diagram p5: BSPD - AMS.SchDoc]

### Parts
C20  value 100nF  [CAP0603]  (hidden comment: C0603C104K3RAC7013)
C21  value 100nF  [CAP0603]  (hidden comment: C0603C104K3RAC7013)
C22  value 100nF  [CAP0603]  (hidden comment: C0603C104K3RAC7013)
C23  value 100nF  [CAP0603]  (hidden comment: C0603C104K3RAC7013)
C24  value 100nF  [CAP0603]  (hidden comment: C0603C104K3RAC7013)
C25  value 100nF  [CAP0603]  (hidden comment: C0603C104K3RAC7013)
C26  value 100nF  [CAP0603]  (hidden comment: C0603C104K3RAC7013)
C27  value 100nF  [CAP0603]  (hidden comment: C0603C104K3RAC7013)
R19  value 7.15k  [RESC1608X55N]  (hidden comment: RN73C1J7K15BTDF)
R20  value 10k  [RESC1608X55N]  (hidden comment: RC0603FR-1310KL)
R21  value 10k  [RESC1608X55N]  (hidden comment: RC0603FR-1310KL)
R22  value 10k  [RESC1608X55N]  (hidden comment: RC0603FR-1310KL)
R23  value 10k  [RESC1608X55N]  (hidden comment: RC0603FR-1310KL)
R24  value 5k  [RESC1608X55N]  (hidden comment: CR0603AFX-5101EAS)
R25  value 220K  [RESC1608X55N]  (hidden comment: CRCW0603-220K-E3)
R26  value 10k  [RESC1608X55N]  (hidden comment: RC0603FR-1310KL)
R27  value 36.5K  [RESC1608X55N]  (hidden comment: CRCW060336K5FKEAC)
R57  value 100  [R-0603]  (hidden comment: Resistor)
U4  SN65LVDT2DBVT  [FP-DBV0005A-MFG]  (value not drawn)
U5  MCP6542-I/SN  [SOIC-SN8_N]  (parts A,B of 2)
U6  SN74LVC1G08MDBVREP  [SOT95P280X145-5N]  (value not drawn)
U7  NC7SZ00M5X  [SOT95P280X125-5N]  (value not drawn)
U8  NC7S32M5X  [SOT95P275X110-5N]  (value not drawn)

### Ports
3V3-BSPD (in), BSPD+ (in), BSPD- (in), BSPD-Ready (out), GND (bidir), I-Sig (in)

### Nets
3V3-BSPD: C20.2 C22.2 C23.2 C24.2 C25.2 R19.2 R22.2 R23.2 R27.2 U4.1(VCC) U5.8(VDD) U6.5(VCC) U7.5(VCC) U8.5(VCC) ; port 3V3-BSPD  [project net 3V3-BMS]
GND: C20.1 C21.1 C22.1 C23.1 C24.1 C25.1 C26.1 C27.1 R20.1 R21.1 R26.1 U4.2(GND) U5.4(VSS) U6.3(GND) U7.3(GND) U8.3(GND) ; port GND
BSPD-Ready: U5.7(OUTB) ; port BSPD-Ready
BSPD_N: R23.1 R57.1 U4.4(B) U7.2(B) ; port BSPD-
BSPD_P: R22.1 R57.2 U4.3(A) U7.1(A) ; port BSPD+
CHA+: R24.2 ; port I-Sig
NetC21_2: C21.2 R19.1 R20.2 U5.2(VINA-)
NetC26_2: C26.2 R25.1 U5.6(VINB-)
NetC27_2: C27.2 R26.2 R27.1 U5.5(VINB+)
NetR21_2: R21.2 R24.1 U5.3(VINA+)
NetR25_2: R25.2 U8.4(Y)
NetU4_5: U4.5(R) U6.2(B)
NetU5_1: U5.1(OUTA) U6.1(A)
NetU6_4: U6.4(Y) U8.1(A)
NetU7_4: U7.4(Y) U8.2(B)

### Layout directives
differential pair; differential pair class BSPD: BSPD_N, BSPD_P

### Notes on the sheet
- BSPD:
  Nominal Voltage: 504V
  Current @15kW: 9.92A
  @9.92A current sense = 2.89V
  To protect comparator stepdown current signal by 2/3s.
  Voltage @ BSPD trigger now: 1.93V
  Reference voltage: 1.93V
- (near C21) 1.92V Offset
- (near U6) AND GATE
- (near U8) OR Gate
- (near U5) Low when BSPD trips
- (near U4) High under hard braking
- (near U7) NAND Gate
- (near R57) NP!!

### Library data of the parts
C20-C27 = Cap: Published: 8-Jun-2000; LatestRevisionDate: 17-Jul-2002; LatestRevisionNote: Re-released for DXP Platform.; PackageReference: RAD-0.3; Publisher: Altium Limited; PackageDescription: Radial Cap, Thru-Hole; 2 Leads; 0.3 in Pin Spacing
R19-R21 R24 = Res1: Published: 8-Jun-2000; LatestRevisionDate: 17-Jul-2002; LatestRevisionNote: Re-released for DXP Platform.; PackageReference: AXIAL-0.3; Publisher: Altium Limited; PackageDescription: Axial Device, Thru-Hole; 2 Leads; 0.3 in Pin Spacing
R22 R23 = Res1: 169-4216; Published: 8-Jun-2000; LatestRevisionDate: 17-Jul-2002; LatestRevisionNote: Re-released for DXP Platform.; PackageReference: AXIAL-0.3; Publisher: Altium Limited; PackageDescription: Axial Device, Thru-Hole; 2 Leads; 0.3 in Pin Spacing
R25-R27 = Res1: Resistor; Published: 8-Jun-2000; LatestRevisionDate: 17-Jul-2002; LatestRevisionNote: Re-released for DXP Platform.; PackageReference: AXIAL-0.3; Publisher: Altium Limited; PackageDescription: Axial Device, Thru-Hole; 2 Leads; 0.3 in Pin Spacing
R57 = Resistor: NP
U4 = CMP-04872-000003-1: IC RECEIVER 0/1 SOT23-5; Manufacturer: Texas Instruments; Max Supply Voltage: 3.6V; Standoff Height: 0mm; Nominal Supply Current: 2-5.5mA; Interface: LVDS,LVTTL; Min Supply Voltage: 2.4V; Device Class L3: unset; Category: IC; Automotive: No; Ambient Temperature Range High: +85°C; Ambient Temperature Range Low: -40°C; Temperature Range Low: -40°C; RoHS: TRUE; ComponentLink2Description: Datasheet; Package: DBV0005A; Device Class L1: Integrated Circuits (ICs); Mouser Description: LVDS Interface IC Dual LVDS; Digikey Description: IC RECEIVER 0/1 SOT23-5; ComponentLink2URL: http://www.ti.com/lit/ds/symlink/sn65lvdt2.pdf; Height: 1.45mm; Temperature: -40°C to +85°C; Temperature Range High: +85°C; Lead Free: Yes; Octopart: https://octopart.com/sn65lvdt2dbvt-texas+instruments-712102; Device Class L2: Interface ICs; Manufacturer Part Number: SN65LVDT2DBVT
U5 = CMP-0187-00180-2: Push-Pull Output Sub-Microamp Comparator, 8-Pin SOIC, Industrial Temperature; PackageReference: SOIC-SN8; PackageVersion: revBB, Aug-2009; ComponentLink3URL: http://www.microchip.com/stellent/groups/techpub_sg/documents/packagingspec/en012702.pdf; Code_JEDEC: MS-012; DatasheetVersion: revH, Dec-2011; ComponentLink1URL: http://www.microchip.com/; ComponentLink2Description: Datasheet; RevisionNote: URLs added. DatasheetVersion updated.; ComponentLink2URL: http://ww1.microchip.com/downloads/en/DeviceDoc/21696H.pdf; ComponentLink3Description: Package Specification; ComponentLink1Description: Manufacturer URL; Code_IPC: SOIC127P600-8; PackageDescription: 8-Lead Plastic Small Outline (SN) - Narrow, 3.90mm Body [SOIC]
U6 = SN74LVC1G08MDBVREP: Integrated Circuit; Manufacturer_Name: Texas Instruments; Datasheet Link: http://www.ti.com/lit/gpn/sn74lvc1g08-ep; Height: 1.45mm; Mouser2 Part Number: 595-SN74LVC08MDBVREP; Mouser2 Price/Stock: https://www.mouser.com/Search/Refine.aspx?Keyword=595-SN74LVC08MDBVREP; Manufacturer_Part_Number: SN74LVC1G08MDBVREP
U7 = NC7S02M5X: NAND GATEEE; Manufacturer_Name: ON Semiconductor; Height: 1.25mm; Manufacturer_Part_Number: NC7S02M5X
U8 = NC7S32M5X: OR GATEEEE; Manufacturer_Name: ON Semiconductor; Datasheet Link: https://componentsearchengine.com/Datasheets/2/NC7S32M5X.pdf; Height: 1.1mm; Manufacturer_Part_Number: NC7S32M5X

## Sheet Latching - AMS.SchDoc
size A3
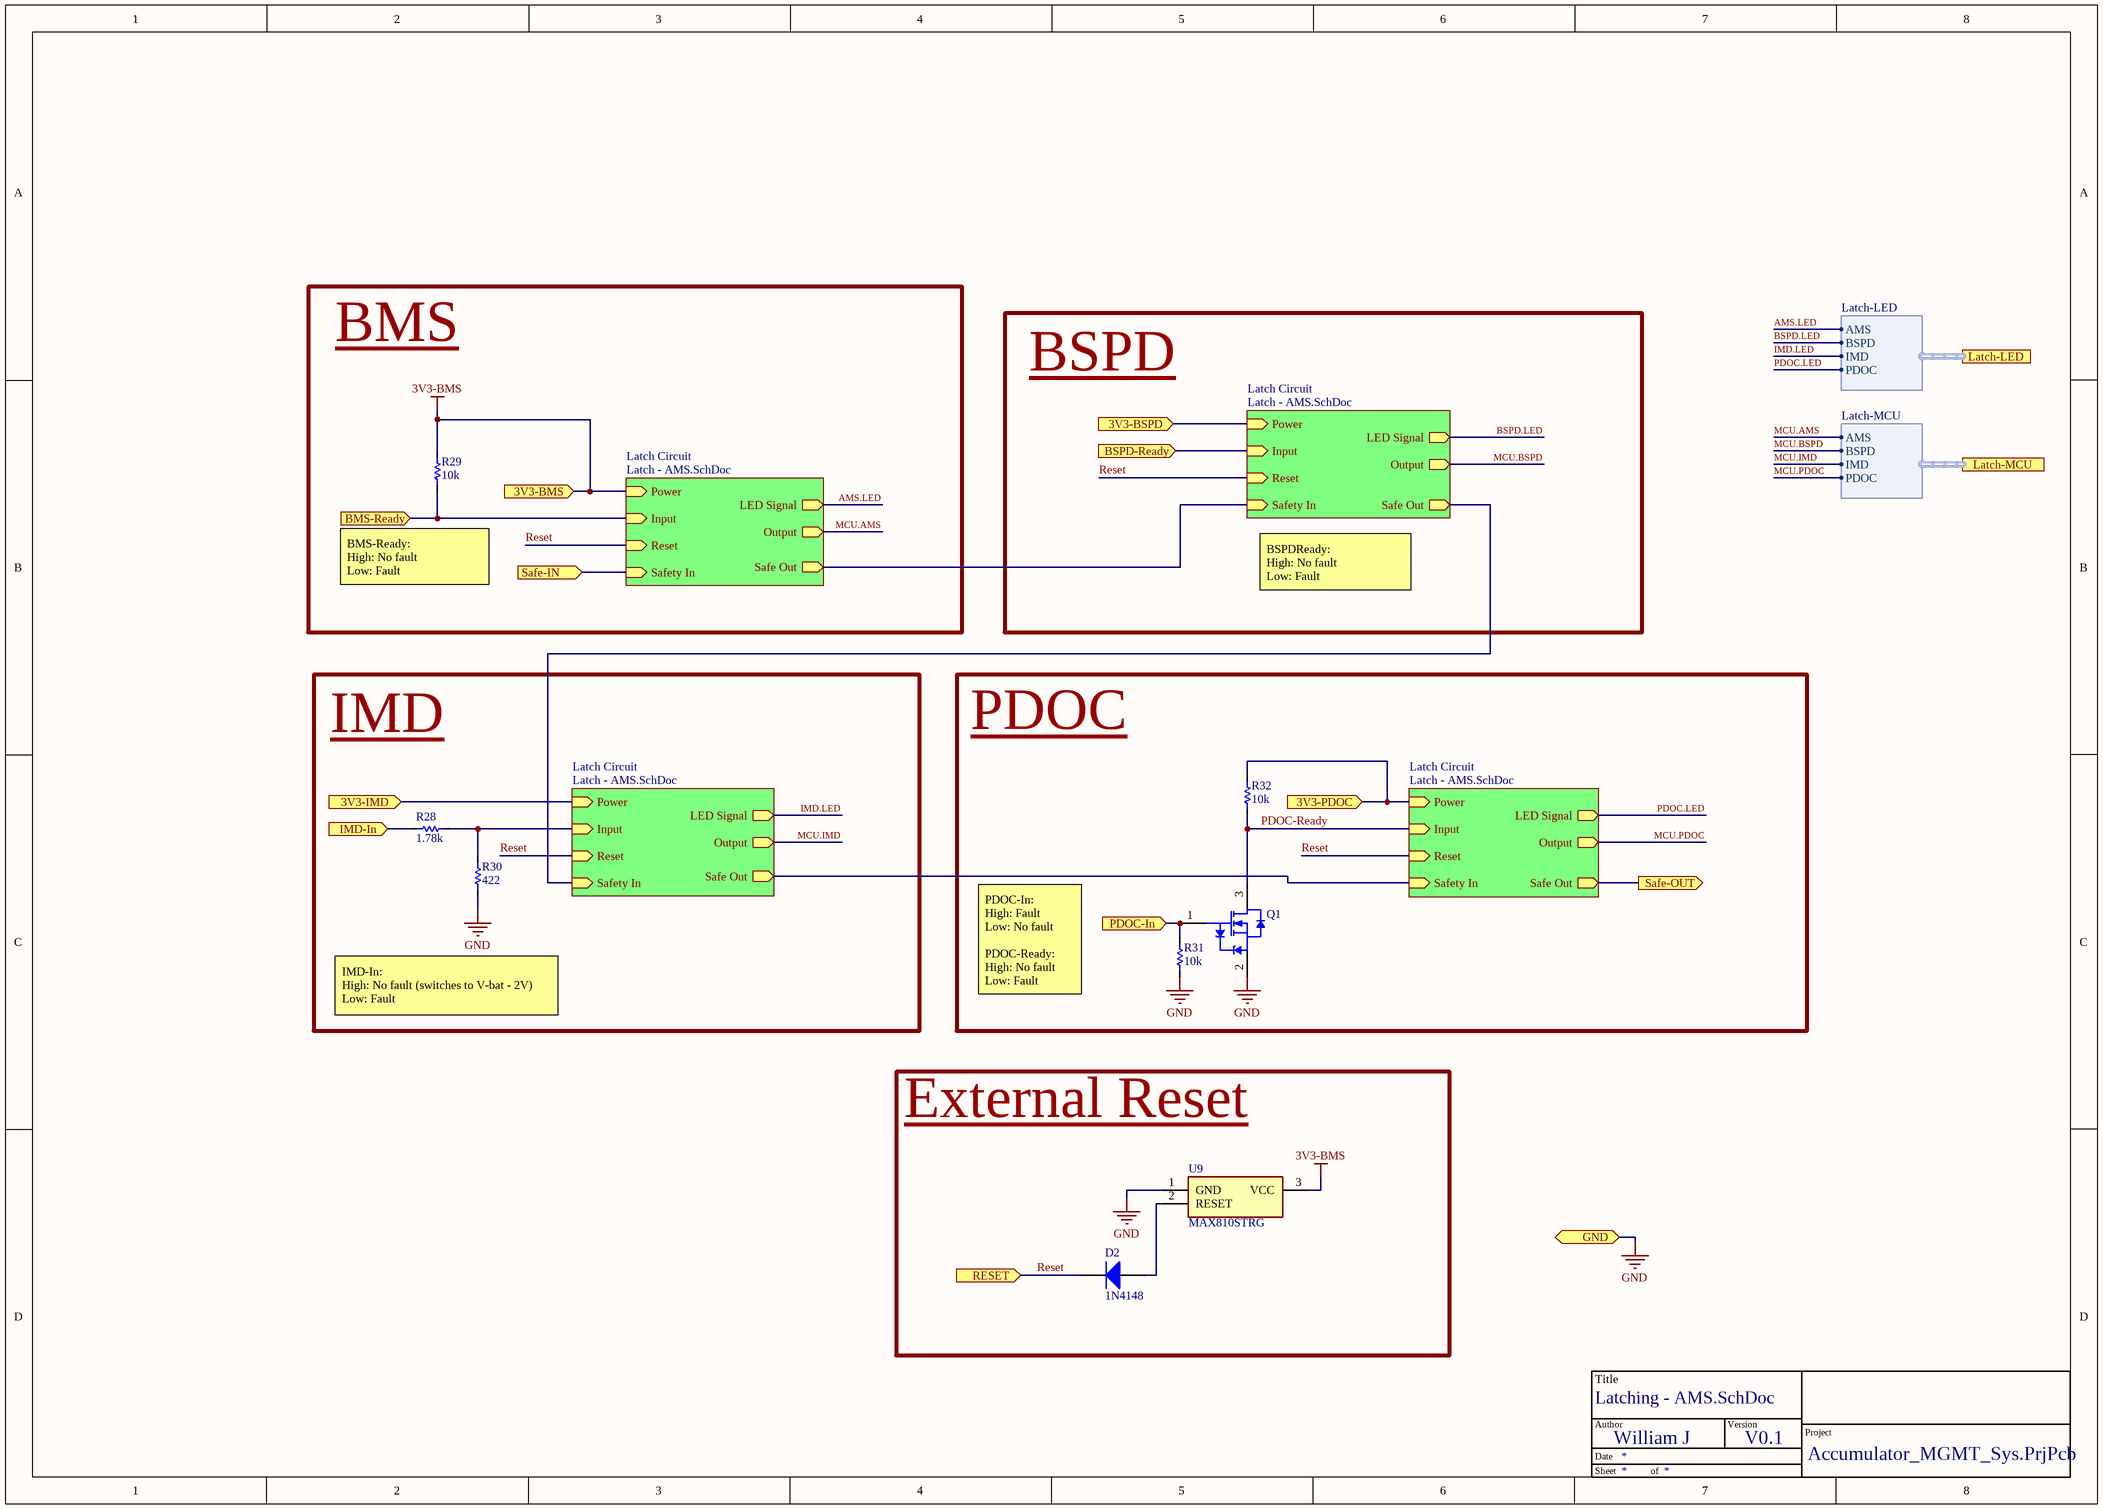
[diagram p6: Latching - AMS.SchDoc]

### Parts
(Parts that share a designator on the sheet are numbered #1, #2 ... from top to bottom, then left to right.)
*#6  TitleBlock  (value not drawn)  (graphical)
D2  1N4148  [425]
Q1  BSS138BK,215  [NXP-SOT23_N]  (value not drawn)
R28  value 1.78k  [R-0603]  (hidden comment: RC0603FR-071K78L)
R29  value 10k  [R-0603]  (hidden comment: RC0603FR-1310KL)
R30  value 422  [R-0603]  (hidden comment: CR0603-FX-4220ELF)
R31  value 10k  [R-0603]  (hidden comment: RC0603FR-1310KL)
R32  value 10k  [R-0603]  (hidden comment: RC0603FR-1310KL)
U9  MAX810STRG  [SOT96P237X111-3N]

### Blocks framed on the sheet
BMS: R29
IMD: R28 R30
PDOC: Q1 R31 R32
External Reset: D2 U9

### Sub-sheets
Latch Circuit = Latch - AMS.SchDoc: Input (in), Safety In (in), Safe Out (out), LED Signal (out), Power (in), Output (out), Reset (in)
Latch Circuit = Latch - AMS.SchDoc: Input (in), Safety In (in), Safe Out (out), LED Signal (out), Power (in), Output (out), Reset (in)
Latch Circuit = Latch - AMS.SchDoc: Input (in), Safety In (in), Safe Out (out), LED Signal (out), Power (in), Output (out), Reset (in)
Latch Circuit = Latch - AMS.SchDoc: Input (in), Safety In (in), Safe Out (out), LED Signal (out), Power (in), Output (out), Reset (in)

### Ports
3V3-BMS (in), 3V3-BSPD (in), 3V3-IMD (in), 3V3-PDOC (in), BMS-Ready (in), BSPD-Ready (in), GND (bidir), IMD-In (in), Latch-LED (harness Latch-LED), Latch-MCU (harness Latch-MCU), PDOC-In (in), RESET (in), Safe-IN (in), Safe-OUT (out)

### Harnesses
Latch-LED: AMS, BSPD, IMD, PDOC
Latch-MCU: AMS, BSPD, IMD, PDOC

### Nets
3V3-BMS: R29.2 R32.2 U9.3(VCC) ; port 3V3-BSPD, port 3V3-IMD, port 3V3-BMS, port 3V3-PDOC, sheet Latch Circuit/Power, sheet Latch Circuit/Power, sheet Latch Circuit/Power, sheet Latch Circuit/Power
GND: Q1.2(S) R30.1 R31.1 U9.1(GND) ; port GND
AMS.LED: sheet Latch Circuit/LED Signal, port Latch-LED.AMS
BMS-Ready: R29.1 ; port BMS-Ready, sheet Latch Circuit/Input
BSPD-Ready: port BSPD-Ready, sheet Latch Circuit/Input
BSPD.LED: sheet Latch Circuit/LED Signal, port Latch-LED.BSPD
IMD-In: R28.2 ; port IMD-In
IMD.LED: sheet Latch Circuit/LED Signal, port Latch-LED.IMD
MCU.AMS: sheet Latch Circuit/Output, port Latch-MCU.AMS
MCU.BSPD: sheet Latch Circuit/Output, port Latch-MCU.BSPD
MCU.IMD: sheet Latch Circuit/Output, port Latch-MCU.IMD
MCU.PDOC: sheet Latch Circuit/Output, port Latch-MCU.PDOC
PDOC-In: Q1.1(G) R31.2 ; port PDOC-In
PDOC-Ready: Q1.3(D) R32.1 ; sheet Latch Circuit/Input
PDOC.LED: sheet Latch Circuit/LED Signal, port Latch-LED.PDOC
Reset: D2.2(K) ; port RESET, sheet Latch Circuit/Reset, sheet Latch Circuit/Reset, sheet Latch Circuit/Reset, sheet Latch Circuit/Reset
Safe-IN: port Safe-IN, sheet Latch Circuit/Safety In
Safe-OUT: port Safe-OUT, sheet Latch Circuit/Safe Out
NetD2_1: D2.1(A) U9.2(RESET)
NetIC1_Latch_Circuit4_3: R28.1 R30.2 ; sheet Latch Circuit/Input
NetK1_Latch_Circuit1_11: sheet Latch Circuit/Safe Out, sheet Latch Circuit/Safety In
NetK1_Latch_Circuit1_14: sheet Latch Circuit/Safety In, sheet Latch Circuit/Safe Out
NetK1_Latch_Circuit2_11: sheet Latch Circuit/Safe Out, sheet Latch Circuit/Safety In

### Notes on the sheet
- BSPD
- (near R29) BMS-Ready:
  High: No fault
  Low: Fault
- BSPDReady:
  High: No fault
  Low: Fault
- PDOC-In:
  High: Fault
  Low: No fault
  PDOC-Ready:
  High: No fault
  Low: Fault
- IMD-In:
  High: No fault (switches to V-bat - 2V)
  Low: Fault
- (in symbol TitleBlock) Title; Author; Version; Project; Date; Sheet; of

### Library data of the parts
D2 = 1N4148W-7-F: DIODE GEN PURP 100V 300MA SOD123; Manufacturer 1: Diodes; Forward Current: 150mA; Element Configuration: Single; Reverse Recovery Time: 4ns; Max Forward Surge Current (Ifsm): 2A; Polarity: Standard; Voltage Rating (DC): 75V; Power Rating: 400mW; Capacitance: 2pF; Peak Reverse Current: 1uA; Forward Voltage: 1.25V; Supplier 1: Digi-Key; Supplier Part Number 1: 1N4148W-FDIDKR-ND; Manufacturer Part Number 1: 1N4148W-7-F; Stock 1: 3523690; Pricing 1: 1=0.16000, 10=0.14600, 25=0.13880, 100=0.06110, 250=0.05868, 500=0.04800, 1000=0.03333 (USD); RoHS: Yes; Mount: Surface Mount; Number of Pins: 2; Weight: 0.000353oz; Contact Plating: Tin,Matte; Min Operating Temperature: -65°C; Max Operating Temperature: 150°C; Voltage: 100V; Packaging: Tape and Reel; Max Repetitive Reverse Voltage (Vrrm): 100V; Peak Non-Repetitive Surge Current: 2A; Current Rating: 150mA; Output Current: 150mA; Max Surge Current: 2A; Package Quantity: 3000; Recovery Time: 4ns; Max Reverse Voltage (DC): 100V; Average Rectified Current: 300mA; Power Dissipation: 400mW; Length: 2.85mm; Height: 1.25mm; Width: 1.7mm; Radiation Hardening: No; REACH SVHC: No SVHC; Lead Free: Lead Free; ComponentLink1URL: https://datasheet.ciiva.com/911/ds30086-911734.pdf?src-supplier=Digi-Key; ComponentLink1Description: https://datasheet.ciiva.com/911/ds30086-911734.pdf?src-supplier=Digi-Key; ComponentLink2URL: https://datasheet.ciiva.com/911/ds30086-911735.pdf?src-supplier=Digi-Key; ComponentLink2Description: https://datasheet.ciiva.com/911/ds30086-911735.pdf?src-supplier=Digi-Key; ComponentLink3URL: https://datasheet.ciiva.com/911/ds30086-911736.pdf?src-supplier=Digi-Key; ComponentLink3Description: https://datasheet.ciiva.com/911/ds30086-911736.pdf?src-supplier=Digi-Key; ComponentLink4URL: https://datasheet.ciiva.com/8300/ds30086-8300392.pdf?src-supplier=Avnet; ComponentLink4Description: https://datasheet.ciiva.com/8300/ds30086-8300392.pdf?src-supplier=Avnet; ComponentLink5URL: https://datasheet.ciiva.com/25919/ds30086-25919609.pdf?src-supplier=Avnet+Europe; ComponentLink5Description: https://datasheet.ciiva.com/25919/ds30086-25919609.pdf?src-supplier=Avnet+Europe; ComponentLink6URL: https://datasheet.ciiva.com/22695/1915529-22695239.pdf?src-supplier=Element14; ComponentLink6Description: https://datasheet.ciiva.com/22695/1915529-22695239.pdf?src-supplier=Element14; ComponentLink7URL: https://datasheet.ciiva.com/1179/1915529-1179304.pdf?src-supplier=Element14; ComponentLink7Description: https://datasheet.ciiva.com/1179/1915529-1179304.pdf?src-supplier=Element14; ComponentLink8URL: https://datasheet.ciiva.com/4435/ds30086-4435128.pdf?src-supplier=Mouser; ComponentLink8Description: https://datasheet.ciiva.com/4435/ds30086-4435128.pdf?src-supplier=Mouser; ComponentLink9URL: https://datasheet.ciiva.com/15219/getdatasheetpartid-110030-15219548.pdf?src-supplier=Verical; ComponentLink9Description: https://datasheet.ciiva.com/15219/getdatasheetpartid-110030-15219548.pdf?src-supplier=Verical; ComponentLink10URL: https://datasheet.ciiva.com/8303/ds30086-8303197.pdf?src-supplier=Avnet; ComponentLink10Description: https://datasheet.ciiva.com/8303/ds30086-8303197.pdf?src-supplier=Avnet
Q1 = CMP-1259-00087-1: N-Channel Trench MOSFET, 60 V, 0.36 A, -55 to 150 degC, 3-Pin SOT23, Tape and Reel; Manufacturer: NXP Semiconductors; Channel Type: N; IDM [max] (A): 1.2; VDS [max] (V): 60; Packing: Tape & Reel; ID [max] (A): 0.36; Automotive Qualified: Y; VGSth [typ] (V): 1.1; PackageReference: SOT23; Code_JEDEC: TO-236AB; PackageDescription: 3-Pin Small Outline Transistor Package, Body 2.9 x 1.3 mm, Pitch 0.95 mm; ComponentLink2URL: http://www.nxp.com/documents/data_sheet/BSS138BK.pdf; PartNumber: BSS138BK,215; DatasheetVersion: Rev. 1; ComponentLink3Description: Package Specification; ComponentLink3URL: http://www.nxp.com/documents/outline_drawing/sot023_po.pdf; Mounting Technology: Surface Mount; ComponentLink1URL: http://www.nxp.com/; ComponentLink1Description: Manufacturer URL; ComponentLink2Description: Datasheet; PackageVersion: 06-03-16, 03/2006
R28-R32 = Resistor
U9 = MAX810TTRG: Integrated Circuit; Manufacturer_Name: ON Semiconductor; Datasheet Link: http://www.onsemi.com/pub/Collateral/MAX809S-D.PDF; Height: 1.11mm; Manufacturer_Part_Number: MAX810TTRG